# EAGLE design lil_gate_sequencer (EAGLE 7.1.0)
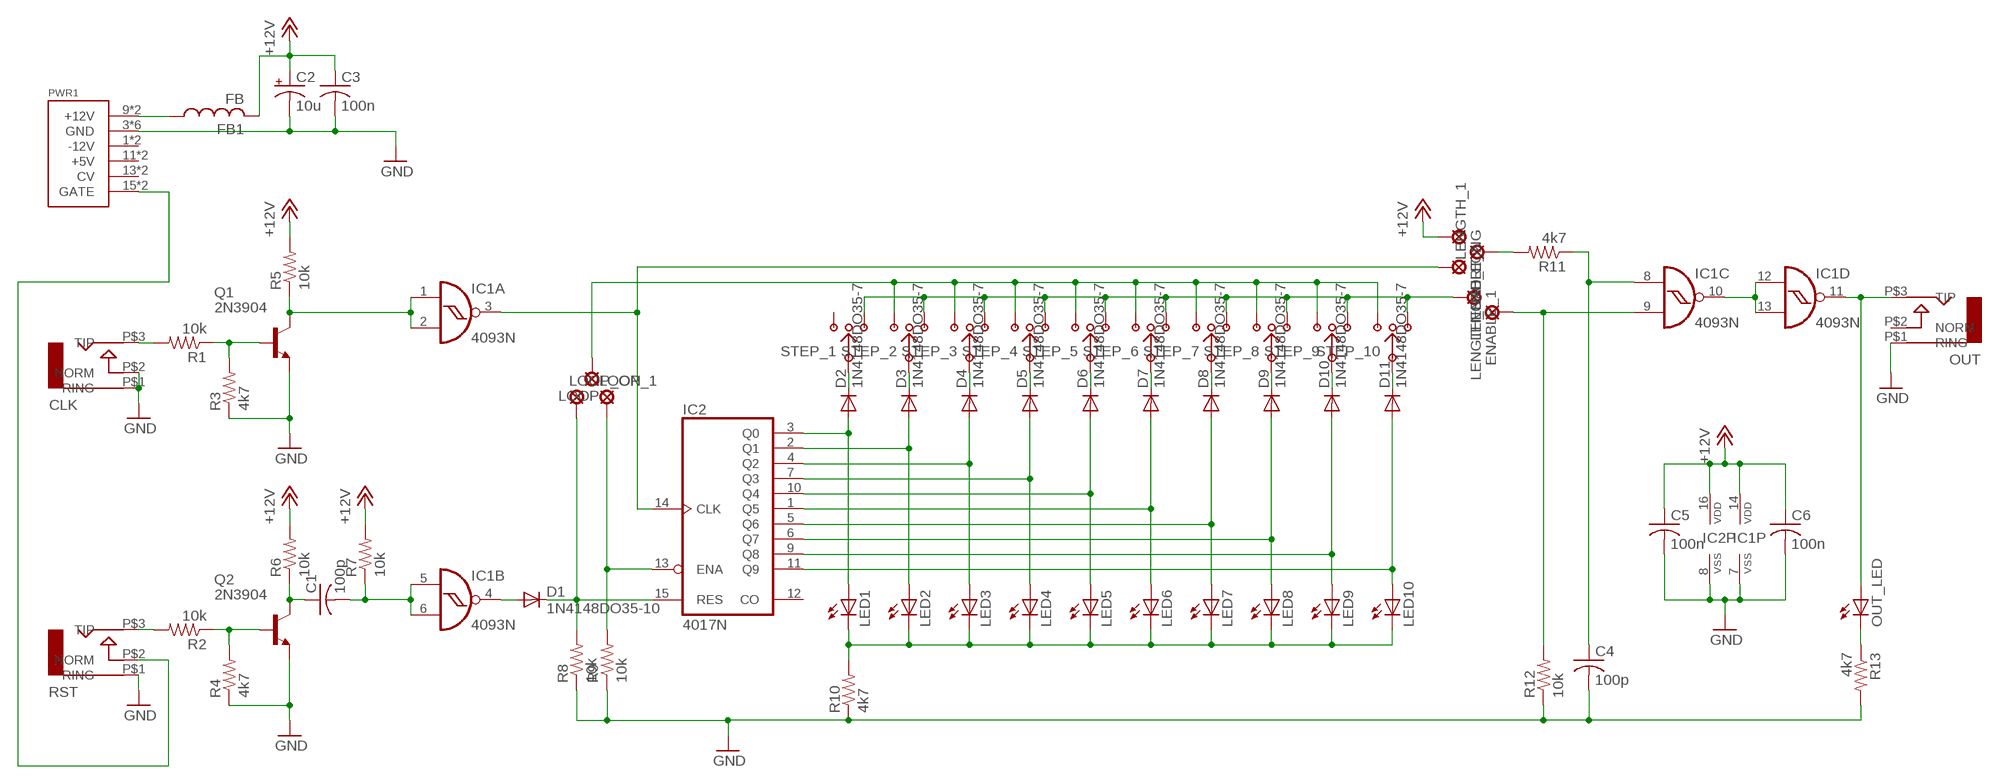
[diagram p0: schematic, sheet 1]

## Parts
C1  100p  C-US050-024X044  [C050-024X044]
C2  10u  CPOL-USB45181B  [B45181B]
C3  100n  C-US050-024X044  [C050-024X044]
C4  100p  C-US050-024X044  [C050-024X044]
C5  100n  C-US050-024X044  [C050-024X044]
C6  100n  C-US050-024X044  [C050-024X044]
CLK  AUDIO-JACK  [ERTHENVAR-JACK-90DEG]
D1  1N4148DO35-10  [DO35-10]
D2  1N4148DO35-7  [DO35-7]
D3  1N4148DO35-7  [DO35-7]
D4  1N4148DO35-7  [DO35-7]
D5  1N4148DO35-7  [DO35-7]
D6  1N4148DO35-7  [DO35-7]
D7  1N4148DO35-7  [DO35-7]
D8  1N4148DO35-7  [DO35-7]
D9  1N4148DO35-7  [DO35-7]
D10  1N4148DO35-7  [DO35-7]
D11  1N4148DO35-7  [DO35-7]
ENABLE_1  LSP11  [LSP11]
ENABLE_2  LSP11  [LSP11]
FB1  FB  [FB]
IC1  4093N  [DIL14]
IC2  4017N  [DIL16]
LED1  LED5MM  [LED5MM]
LED2  LED5MM  [LED5MM]
LED3  LED5MM  [LED5MM]
LED4  LED5MM  [LED5MM]
LED5  LED5MM  [LED5MM]
LED6  LED5MM  [LED5MM]
LED7  LED5MM  [LED5MM]
LED8  LED5MM  [LED5MM]
LED9  LED5MM  [LED5MM]
LED10  LED5MM  [LED5MM]
LENGTH_1  LSP11  [LSP11]
LENGTH_LONG  LSP11  [LSP11]
LENGTH_SHORT  LSP11  [LSP11]
LOOP  LSP11  [LSP11]
LOOP_1  LSP11  [LSP11]
LOOP_ON  LSP11  [LSP11]
OUT  AUDIO-JACK  [ERTHENVAR-JACK-90DEG]
OUT_LED  LED5MM  [LED5MM]
PWR1  POWER  [POWER_16]
Q1  2N3904  [TO92]
Q2  2N3904  [TO92]
R1  10k  R-US_0207/7  [0207/7]
R2  10k  R-US_0207/7  [0207/7]
R3  4k7  R-US_0207/7  [0207/7]
R4  4k7  R-US_0207/7  [0207/7]
R5  10k  R-US_0207/7  [0207/7]
R6  10k  R-US_0207/7  [0207/7]
R7  10k  R-US_0207/7  [0207/7]
R8  10k  R-US_0207/7  [0207/7]
R9  10k  R-US_0207/7  [0207/7]
R10  4k7  R-US_0207/7  [0207/7]
R11  4k7  R-US_0207/7  [0207/7]
R12  10k  R-US_0207/7  [0207/7]
R13  4k7  R-US_0207/7  [0207/7]
RST  AUDIO-JACK  [ERTHENVAR-JACK-90DEG]
STEP_1  MTS-102-C4  [MTS-102-C4]
STEP_2  MTS-102-C4  [MTS-102-C4]
STEP_3  MTS-102-C4  [MTS-102-C4]
STEP_4  MTS-102-C4  [MTS-102-C4]
STEP_5  MTS-102-C4  [MTS-102-C4]
STEP_6  MTS-102-C4  [MTS-102-C4]
STEP_7  MTS-102-C4  [MTS-102-C4]
STEP_8  MTS-102-C4  [MTS-102-C4]
STEP_9  MTS-102-C4  [MTS-102-C4]
STEP_10  MTS-102-C4  [MTS-102-C4]

## Nets
+12V: C2.+ C3.1 C5.1 C6.1 FB1.P$2 IC1.14(P:VDD) IC2.16(VDD) LENGTH_LONG.MP R5.2 R6.2 R7.2
GND: C2.- C3.2 C4.2 C5.2 C6.2 CLK.P$1(RING) CLK.P$2(NORM) IC1.7(P:VSS) IC2.8(VSS) OUT.P$1(RING) PWR1.3(GND) PWR1.4(GND) PWR1.5(GND) PWR1.6(GND) PWR1.7(GND) PWR1.8(GND) Q1.3(E) Q2.3(E) R3.1 R4.1 R8.1 R9.1 R10.1 R12.1 R13.2 RST.P$1(RING)
N$1: FB1.P$1 PWR1.9(+12V) PWR1.10(+12V)
N$2: Q2.2(B) R2.1 R4.2
N$3: D1.A IC1.4(B:O)
N$4: Q1.2(B) R1.1 R3.2
N$5: IC1.1(A:I0) IC1.2(A:I1) Q1.1(C) R5.1
N$6: IC1.11(D:O) OUT.P$3(TIP) OUT_LED.A
N$7: CLK.P$3(TIP) R1.2
N$8: R2.2 RST.P$3(TIP)
N$9: D1.C IC2.15(RES) LOOP_ON.MP R8.2
N$10: C1.2 IC1.5(B:I0) IC1.6(B:I1) R7.1
N$11: C1.1 Q2.1(C) R6.1
N$12: IC1.3(A:O) IC2.14(CLK) LENGTH_SHORT.MP
N$13: D2.C STEP_1.P$2
N$14: IC2.13(ENA) LOOP_1.MP R9.2
N$15: D2.A IC2.3(Q0) LED1.A
N$16: D3.C STEP_2.P$2
N$17: D3.A IC2.2(Q1) LED2.A
N$18: D4.C STEP_3.P$2
N$19: D4.A IC2.4(Q2) LED3.A
N$20: D5.C STEP_4.P$2
N$21: D5.A IC2.7(Q3) LED4.A
N$22: D6.C STEP_5.P$2
N$23: D6.A IC2.10(Q4) LED5.A
N$24: D7.C STEP_6.P$2
N$25: D7.A IC2.1(Q5) LED6.A
N$26: D8.C STEP_7.P$2
N$27: D8.A IC2.5(Q6) LED7.A
N$28: D9.C STEP_8.P$2
N$29: D9.A IC2.6(Q7) LED8.A
N$30: D10.C STEP_9.P$2
N$31: D10.A IC2.9(Q8) LED9.A
N$32: D11.C STEP_10.P$2
N$33: D11.A IC2.11(Q9) LED10.A
N$34: LOOP.MP STEP_2.P$3 STEP_3.P$3 STEP_4.P$3 STEP_5.P$3 STEP_6.P$3 STEP_7.P$3 STEP_8.P$3 STEP_9.P$3 STEP_10.P$3
N$35: LED1.K(C) LED2.K(C) LED3.K(C) LED4.K(C) LED5.K(C) LED6.K(C) LED7.K(C) LED8.K(C) LED9.K(C) LED10.K(C) R10.2
N$36: ENABLE_1.MP STEP_1.P$1 STEP_2.P$1 STEP_3.P$1 STEP_4.P$1 STEP_5.P$1 STEP_6.P$1 STEP_7.P$1 STEP_8.P$1 STEP_9.P$1 STEP_10.P$1
N$37: LENGTH_1.MP R11.2
N$38: ENABLE_2.MP IC1.9(C:I1) R12.2
N$39: PWR1.15(GATE) PWR1.16(GATE) RST.P$2(NORM)
N$41: C4.1 IC1.8(C:I0) R11.1
N$42: IC1.10(C:O) IC1.12(D:I0) IC1.13(D:I1)
N$43: OUT_LED.K(C) R13.1
Unconnected: IC2.12(CO) OUT.P$2(NORM) PWR1.1(-12V) PWR1.2(-12V) PWR1.11(+5V) PWR1.12(+5V) PWR1.13(CV) PWR1.14(CV) STEP_1.P$3

## Library data of the parts
C1 C3-C6 = rcl:C-US: CAPACITOR, American symbol
C2 = rcl:CPOL-US: POLARIZED CAPACITOR, American symbol
CLK OUT RST = erthenvar:AUDIO-JACK: Switching Mono 3.5mm Audio Jack from Erthenvar.
D1-D11 = diode:1N4148: DIODE high speed (Philips)
ENABLE_1 ENABLE_2 LENGTH_1 LENGTH_LONG LENGTH_SHORT LOOP LOOP_1 LOOP_ON = solpad:LSP11: SOLDER PAD drill 1.1 mm
FB1 = adafruit:FB: Ferrite bead Digikey #P9821BK-ND
IC1 = 40xx:4093: Quad 2-input NAND schmitt trigger
IC2 = 40xx:4017: COUNTER/DIVIDER
LED1-LED10 OUT_LED = led:LED: LED OSRAM: - CHIPLED LG R971, LG N971, LY N971, LG Q971, LY Q971, LO R971, LY R971 LH N974, LH R974 LS Q976, LO Q976, LY Q976 LO Q996 - Hyper CHIPLED LW Q18S LB Q993, LB Q99A, LB R99A - SideLED LS A670, LO A670, LY A670, LG A670, LP A670 LB A673, LV A673, LT A673, LW A673 LH A674 LY A675 LS A676, LA A676, LO A676, LY A676, LW A676 LS A679, LY A679, LG A679 - Hyper Micro SIDELED® LS Y876, LA Y876, LO Y876, LY Y876 LT Y87S - SmartLED LW L88C, LW L88S LB L89C, LB L89S, LG L890 LS L89K, LO L89K, LY L89K LS L896, LA L896, LO L896, LY L896 - TOPLED LS T670, LO T670, LY T670, LG T670, LP T670 LSG T670, LSP T670, LSY T670, LOP T670, LYG T670 LG T671, LOG T671, LSG T671 LB T673, LV T673, LT T673, LW T673 LH T674 LS T676, LA T676, LO T676, LY T676, LB T676, LH T676, LSB T676, LW T676 LB T67C, LV T67C, LT T67C, LS T67K, LO T67K, LY T67K, LW E67C LS E67B, LA E67B, LO E67B, LY E67B, LB E67C, LV E67C, LT E67C LW T67C LS T679, LY T679, LG T679 LS T770, LO T770, LY T770, LG T770, LP T770 LB T773, LV T773, LT T773, LW T773 LH T774 LS E675, LA E675, LY E675, LS T675 LS T776, LA T776, LO T776, LY T776, LB T776 LHGB T686 LT T68C, LB T68C - Hyper Mini TOPLED® LB M676 - Mini TOPLED Santana® LG M470 LS M47K, LO M47K, LY M47K Source: http://www.osram.convergy.de LUXEON: - LUMILED® LXK2-PW12-R00, LXK2-PW12-S00, LXK2-PW14-U00, LXK2-PW14-V00 LXK2-PM12-R00, LXK2-PM12-S00, LXK2-PM14-U00 LXK2-PE12-Q00, LXK2-PE12-R00, LXK2-PE12-S00, LXK2-PE14-T00, LXK2-PE14-U00 LXK2-PB12-K00, LXK2-PB12-L00, LXK2-PB12-M00, LXK2-PB14-N00, LXK2-PB14-P00, LXK2-PB14-Q00 LXK2-PR12-L00, LXK2-PR12-M00, LXK2-PR14-Q00, LXK2-PR14-R00 LXK2-PD12-Q00, LXK2-PD12-R00, LXK2-PD12-S00 LXK2-PH12-R00, LXK2-PH12-S00 LXK2-PL12-P00, LXK2-PL12-Q00, LXK2-PL12-R00 Source: www.luxeon.com KINGBRIGHT: KA-3528ASYC Source: www.kingbright.com
PWR1 = eurorack:POWER
Q1 Q2 = transistor-npn:2N3904: NPN Transistor
R1-R13 = rcl:R-US_: RESISTOR, American symbol
STEP_1-STEP_10 = jameco:MTS-102-C4

## Board
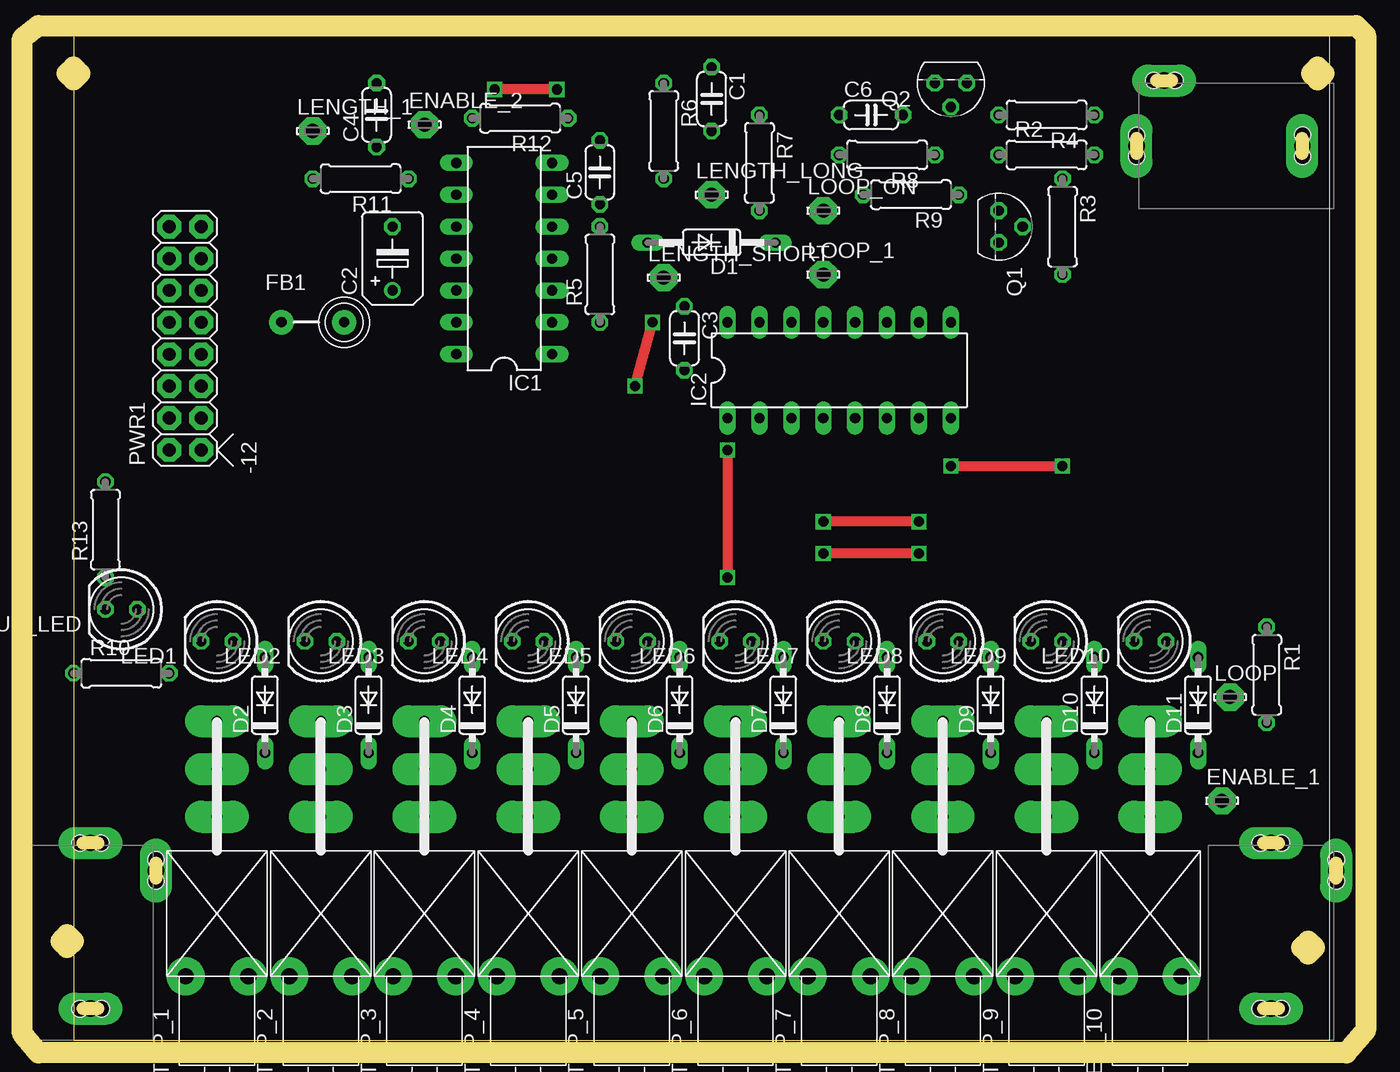
[diagram p1: board, top side]
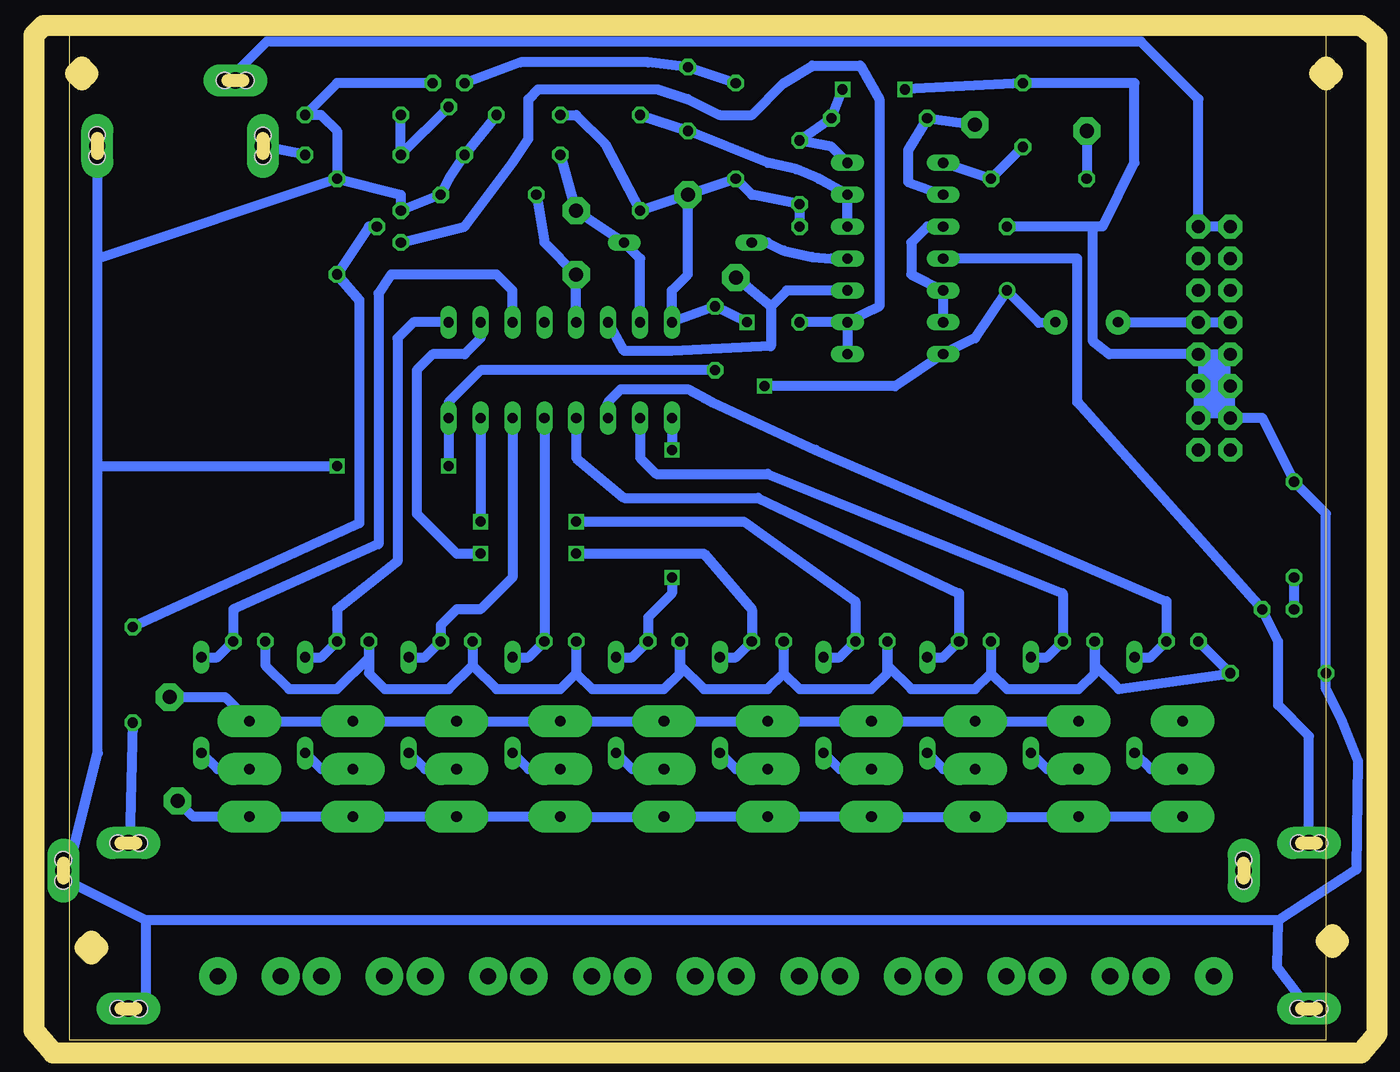
[diagram p2: board, bottom side, seen from below]

Size 100 x 80 mm. Coordinates in mm from the lower left corner, seen from the top.
Outline: 0,0 100,0 100,80 0,80 0,0
Copper layers (1*16): Top 0.035mm / dielectric 1.5mm / Bottom 0.035mm
Design rules "default *": minimum track width 32mil, minimum drill 31mil, track to track 16mil, track to pad 16mil, pad to pad 16mil, via to via 16mil, smd to smd 8mil, copper to edge 0mil, drill to drill 16mil, minimum pad ring 10mil, minimum via ring 8mil, stop-mask expansion 4mil, vias tented up to drill 0mil, thermal gap 10mil
Milling: 24 lines

### Footprints (pad centres in the part's own frame; a part is rotated, then mirrored left to right if it is on the bottom)
C050-024X044 = drill 0.813 octagon: 1 -2.54,0; 2 2.54,0
B45181B = drill 0.813: + -2.54,0 | drill 0.813 octagon: - 2.54,0
ERTHENVAR-JACK-90DEG = drill 1.3 pad 2.54 long: P$1 5,-2.5; P$2 -0.2,-13.5; P$3 5,-15.7 | hole 1.3: 5.842,-2.489; 4.14,-2.489; -0.203,-12.649; -0.203,-14.351; 5.842,-15.697; 4.166,-15.697
DO35-10 = drill 0.813 long: A 5.08,0; C -5.08,0
DO35-7 = drill 0.813 long: A 3.81,0; C -3.81,0
LSP11 = drill 1.118 pad 2.159 octagon: MP 0,0
FB = drill 0.8 pad 1.93: P$1 -2.5,0; P$2 2.5,0
DIL14 = drill 0.813 long: 1 -7.62,-3.81; 2 -5.08,-3.81; 3 -2.54,-3.81; 4 0,-3.81; 5 2.54,-3.81; 6 5.08,-3.81; 7 7.62,-3.81; 8 7.62,3.81; 9 5.08,3.81; 10 2.54,3.81; 11 0,3.81; 12 -2.54,3.81; 13 -5.08,3.81; 14 -7.62,3.81
DIL16 = drill 0.813 long: 1 -8.89,-3.81; 2 -6.35,-3.81; 3 -3.81,-3.81; 4 -1.27,-3.81; 5 1.27,-3.81; 6 3.81,-3.81; 7 6.35,-3.81; 8 8.89,-3.81; 9 8.89,3.81; 10 6.35,3.81; 11 3.81,3.81; 12 1.27,3.81; 13 -1.27,3.81; 14 -3.81,3.81; 15 -6.35,3.81; 16 -8.89,3.81
LED5MM = drill 0.813 octagon: A -1.27,0; K 1.27,0
POWER_16 = drill 1.016 pad 1.88 octagon: 1 -6.35,-1.27; 2 -6.35,1.27; 3 -3.81,-1.27; 4 -3.81,1.27; 5 -1.27,-1.27; 6 -1.27,1.27; 7 1.27,-1.27; 8 1.27,1.27; 9 3.81,-1.27; 10 3.81,1.27; 11 6.35,-1.27; 12 6.35,1.27; 13 8.89,-1.27; 14 8.89,1.27; 15 11.43,-1.27; 16 11.43,1.27
TO92 = drill 0.813 octagon: 1 1.27,0; 2 0,1.905; 3 -1.27,0
0207/7 = drill 0.813 octagon: 1 -3.81,0; 2 3.81,0
MTS-102-C4 = drill 0.85 pad 2.54 long: P$1 0,12.7; P$2 0,16.5; P$3 0,20.3 | drill 1.3 pad 3: PG$2 -2.5,0; PG$5 2.5,0

### Placement (x,y rotation side)
C1  50.8,74.93 270 top
C2  25.4,62.23 90 top
C3  48.64,55.88 270 top
C4  24.13,73.66 90 top
C5  41.91,69.09 90 top
C6  63.5,73.66 0 top
CLK  100.33,0 180 top
D1  50.8,63.5 180 top
D2  15.24,26.67 90 top
D3  23.5,26.67 90 top
D4  31.75,26.67 90 top
D5  40.01,26.67 90 top
D6  48.26,26.67 90 top
D7  56.52,26.67 90 top
D8  64.77,26.67 90 top
D9  73.03,26.67 90 top
D10  81.28,26.67 90 top
D11  89.53,26.67 90 top
ENABLE_1  91.44,19.05 0 top
ENABLE_2  27.94,72.9 0 top
FB1  19.05,57.15 0 top
IC1  34.29,62.23 90 top
IC2  60.96,53.34 0 top
LED1  11.43,31.75 180 top
LED2  19.68,31.75 180 top
LED3  27.94,31.75 180 top
LED4  36.2,31.75 180 top
LED5  44.45,31.75 180 top
LED6  52.7,31.75 180 top
LED7  60.96,31.75 180 top
LED8  69.22,31.75 180 top
LED9  77.47,31.75 180 top
LED10  85.72,31.75 180 top
LENGTH_1  19.05,72.39 0 top
LENGTH_LONG  50.8,67.31 0 top
LENGTH_SHORT  46.99,60.71 0 top
LOOP  92.08,27.3 0 top
LOOP_1  59.69,60.96 0 top
LOOP_ON  59.69,66.04 0 top
OUT  6.35,0 180 top
OUT_LED  3.81,34.29 180 top
PWR1  8.89,53.34 90 top
Q1  73.66,64.77 270 top
Q2  69.85,76.2 180 top
R1  95,29.08 270 top
R2  77.47,70.48 0 top
R3  78.74,64.77 270 top
R4  77.47,73.66 180 top
R5  41.91,60.96 90 top
R6  46.99,72.39 270 top
R7  54.61,69.85 270 top
R8  64.77,70.48 180 top
R9  66.67,67.31 180 top
R10  3.81,29.21 0 top
R11  22.86,68.58 180 top
R12  35.56,73.41 180 top
R13  2.54,40.64 90 top
RST  100.33,76.2 270 top
STEP_1  11.43,5.08 0 top
STEP_2  19.68,5.08 0 top
STEP_3  27.94,5.08 0 top
STEP_4  36.2,5.08 0 top
STEP_5  44.45,5.08 0 top
STEP_6  52.7,5.08 0 top
STEP_7  60.96,5.08 0 top
STEP_8  69.22,5.08 0 top
STEP_9  77.47,5.08 0 top
STEP_10  85.72,5.08 0 top

### Tracks (layer width: path | path; a pad name or v marks a point on that pad's centre or on a via)
+12V  (via drill 0.8)
  Top 0.813: v44.7,52.07 v46.1,57.15
  Bottom 0.813: LENGTH_LONG.MP 50.8,60.96 52.07,59.69 IC2.16 C3.1 v46.1,57.15 | LENGTH_LONG.MP R6.2 45.72,67.31 C5.1 R5.2 | LENGTH_LONG.MP R7.2 57.4,71.37 59.69,73.66 C6.1 | FB1.P$2 22.86,57.11 C2.+ 27.94,55.88 IC1.14 34.29,52.07 v44.7,52.07
GND  (via drill 0.8)  (1 unrouted)
  Top 0.813: v38.48,75.69 v33.53,75.69 | v69.85,45.72 v78.74,45.72
  Bottom 0.813: PWR1.4 PWR1.5 PWR1.3 | PWR1.7 PWR1.6 PWR1.4 | PWR1.7 PWR1.8 | 3.81,9.53 -2.41,13.59 -2.54,22.23 -1.27,25.4 0,27.94 R10.1 0,41.91 R13.2 5.08,49.53 PWR1.4 | 3.81,9.53 93.98,9.53 | 93.98,9.53 100.33,12.7 97.79,22.86 97.79,45.72 | 97.79,45.72 97.79,62.23 | 97.79,62.23 97.79,71.16 RST.P$1 | IC1.7 39.37,71.12 C5.2 R12.1 v38.48,75.69 | C6.2 R8.1 69.85,68.58 R9.1 Q1.3 73.66,67.31 R3.1 | Q2.3 78.74,76.2 R4.1 80.01,73.66 78.74,72.39 R3.1 | 93.98,9.53 93.98,2.42 CLK.P$1 | R3.1 97.79,62.23 | v33.53,75.69 C4.2 15.24,76.2 15.24,69.85 17.78,64.77 18.54,64.77 | 18.54,64.77 C2.- | OUT.P$1 3.89,5.79 3.81,9.53 | C3.2 67.31,53.34 69.85,50.8 IC2.8 v69.85,45.72 | 97.79,45.72 v78.74,45.72 | PWR1.7 17.27,54.61 18.54,55.63 18.54,64.77
N$1
  Bottom 0.813: FB1.P$1 PWR1.9 PWR1.10
N$2
  Bottom 0.813: Q2.2 R2.1 R4.2
N$3
  Bottom 0.813: D1.A 44.45,63.5 43.18,62.87 40.89,62.36 39.37,62.23 IC1.4
N$4
  Bottom 0.813: Q1.2 76.2,64.77 R3.2 76.96,58.93 76.96,41.15 R1.1
N$5
  Bottom 0.813: IC1.2 IC1.1 | IC1.2 R5.1 | Q1.1 68.58,64.77 64.77,69.85 63.5,71.75 63.5,74.93 62.74,75.69 53.21,75.69 50.8,74.93 48.26,73.66 45.72,73.66 43.18,76.2 40.89,77.6 37.08,77.6 35.56,74.93 35.56,58.42 IC1.2
N$6
  Bottom 0.813: OUT.P$3 1.35,24.21 3.81,26.67 3.81,31.75 OUT_LED.A 19.81,50.8 19.81,62.23 IC1.11
N$7
  Bottom 0.813: R1.2 95.25,15.78 CLK.P$3
N$8
  Bottom 0.813: R2.2 84.55,71.12 RST.P$3
N$9
  Bottom 0.813: R8.2 LOOP_ON.MP D1.C 54.61,62.23 IC2.15
N$10
  Bottom 0.813: IC1.5 IC1.6 40.39,68.58 42.16,69.34 44.45,69.85 C1.2 R7.1
N$11
  Bottom 0.813: R6.1 C1.1 53.98,77.85 64.14,77.85 Q2.1
N$12
  Bottom 0.813: IC1.3 42.93,59.69 44.2,58.42 | 44.2,58.42 44.2,55.24 52.07,54.86 55.88,54.86 IC2.14 | 44.2,58.42 LENGTH_SHORT.MP
N$13
  Bottom 0.813: STEP_1.P$2 13.96,21.58 D2.C
N$14
  Bottom 0.813: IC2.13 LOOP_1.MP 62.23,63.5 R9.2
N$15
  Bottom 0.813: D2.A 13.97,30.48 LED1.A 12.7,34.92 40.64,46.99 48.9,50.8 50.8,51.82 56.13,51.82 57.15,50.8 IC2.3
N$16
  Bottom 0.813: STEP_2.P$2 22.21,21.58 D3.C
N$17
  Bottom 0.813: D3.A 22.23,30.48 LED2.A 20.95,35.56 44.45,45.09 53.34,45.09 54.61,46.35 IC2.2
N$18
  Bottom 0.813: STEP_3.P$2 30.47,21.58 D4.C
N$19
  Bottom 0.813: D4.A 30.48,30.48 LED3.A 29.21,35.56 45.21,43.18 55.88,43.18 59.69,46.35 IC2.4
N$20
  Bottom 0.813: STEP_4.P$2 38.73,21.58 D5.C
N$21  (via drill 0.8)
  Top 0.813: v67.31,41.27 v59.69,41.27
  Bottom 0.813: D5.A 38.73,30.48 LED4.A 37.47,34.92 46.35,41.27 v59.69,41.27 | IC2.7 v67.31,41.27
N$22
  Bottom 0.813: STEP_5.P$2 46.98,21.58 D6.C
N$23  (via drill 0.8)
  Top 0.813: v67.31,38.73 v59.69,38.73
  Bottom 0.813: D6.A 46.99,30.48 LED5.A 45.72,34.29 49.53,38.73 v59.69,38.73 | IC2.10 67.31,55.88 68.58,54.61 71.12,54.61 72.39,53.34 72.39,41.91 69.22,38.73 v67.31,38.73
N$24
  Bottom 0.813: STEP_6.P$2 55.23,21.58 D7.C
N$25  (via drill 0.8)
  Top 0.813: v52.07,46.99 v52.07,36.83
  Bottom 0.813: D7.A 55.24,30.48 LED6.A 53.98,33.66 52.07,35.56 v52.07,36.83 | IC2.1 v52.07,46.99
N$26
  Bottom 0.813: STEP_7.P$2 63.49,21.58 D8.C
N$27
  Bottom 0.813: D8.A 63.5,30.48 LED7.A IC2.5
N$28
  Bottom 0.813: STEP_8.P$2 71.75,21.58 D9.C
N$29
  Bottom 0.813: D9.A 71.75,30.48 LED8.A 70.48,33.02 69.22,34.29 67.31,34.29 64.77,36.83 IC2.6
N$30
  Bottom 0.813: STEP_9.P$2 80,21.58 D10.C
N$31
  Bottom 0.813: D10.A 80.01,30.48 LED9.A 78.74,34.29 73.91,38.1 73.91,55.88 72.64,57.15 IC2.9
N$32
  Bottom 0.813: STEP_10.P$2 88.25,21.58 D11.C
N$33
  Bottom 0.813: D11.A 88.27,30.48 LED10.A 87,34.29 75.44,39.5 75.44,59.44 74.42,60.96 66.04,60.96 64.77,59.69 IC2.11
N$34
  Bottom 0.813: STEP_10.P$3 86.36,25.38 86.34,25.4 | LOOP.MP 87.65,27.3 STEP_10.P$3 | STEP_10.P$3 STEP_9.P$3 STEP_8.P$3 STEP_7.P$3 STEP_6.P$3 STEP_5.P$3 STEP_4.P$3 STEP_3.P$3 STEP_2.P$3
N$35
  Bottom 0.813: LED1.K R10.2 16.51,27.94 18.41,29.84 LED2.K 18.41,29.21 19.68,27.94 25.4,27.94 26.67,29.21 | LED10.K 84.45,29.84 82.55,27.94 78.74,27.94 76.2,30.48 LED9.K 76.2,29.21 74.93,27.94 69.85,27.94 67.94,29.84 | LED8.K 67.94,29.84 | 67.94,29.84 66.04,27.94 60.96,27.94 59.69,29.21 | LED7.K 59.69,29.21 | 59.69,29.21 58.42,27.94 52.7,27.94 51.44,29.21 LED6.K 51.44,29.84 49.53,27.94 44.45,27.94 43.18,29.21 | LED5.K 43.18,29.21 | 43.18,29.21 41.91,27.94 36.2,27.94 34.92,29.21 LED4.K 34.92,29.84 33.02,27.94 27.94,27.94 26.67,29.21 | LED3.K 26.67,29.21
N$36
  Bottom 0.813: STEP_1.P$1 STEP_2.P$1 STEP_3.P$1 STEP_4.P$1 STEP_5.P$1 STEP_6.P$1 STEP_7.P$1 STEP_8.P$1 STEP_9.P$1 STEP_10.P$1 90.17,17.78 ENABLE_1.MP
N$37
  Bottom 0.813: LENGTH_1.MP R11.2
N$38
  Bottom 0.813: IC1.9 33.27,68.33 33.27,70.87 R12.2 ENABLE_2.MP
N$39
  Bottom 0.813: PWR1.16 PWR1.15 10.16,74.93 14.73,79.5 84.33,79.5 86.36,77.47 86.36,76.87 RST.P$2
N$41
  Bottom 0.813: IC1.8 R11.1 C4.1
N$42
  Bottom 0.813: IC1.10 31.75,64.77 33.02,63.5 33.02,60.96 IC1.12 IC1.13
N$43
  Bottom 0.813: OUT_LED.K R13.1
(copper drawn outside any net)
  shapes: Bottom area x1